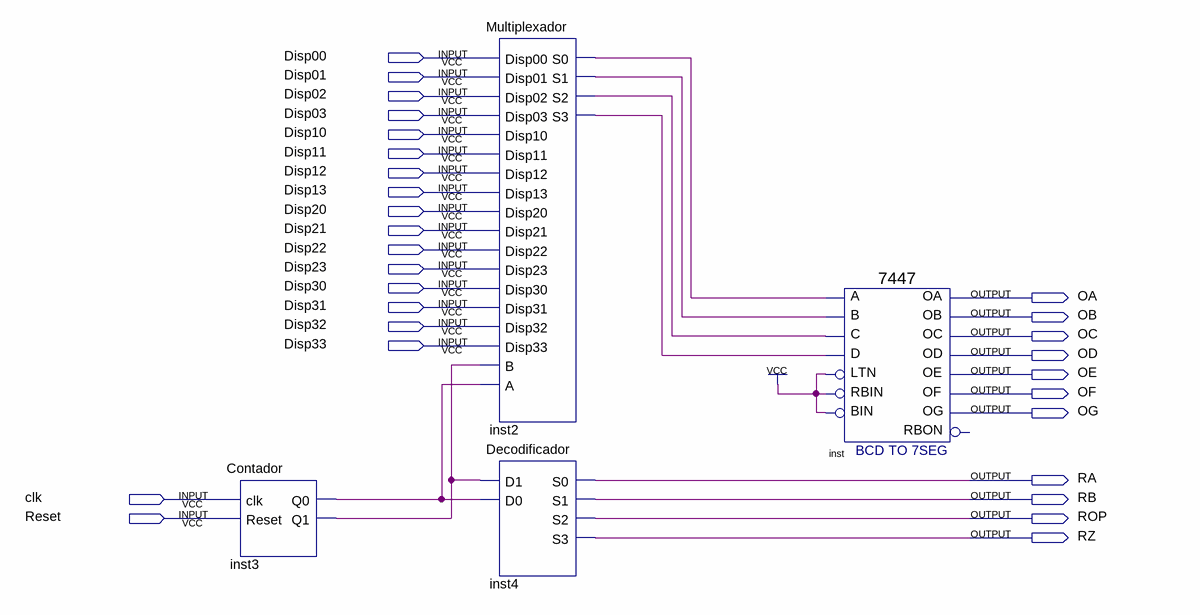
[diagram p0: schematic sheet]
// Quartus schematic Display.bdf as structural Verilog: 4 symbols, 29 pins
module Display (
  input  Disp00,
  input  Disp01,
  input  Disp02,
  input  Disp03,
  input  Disp10,
  input  Disp11,
  input  Disp12,
  input  Disp13,
  input  Disp20,
  input  Disp21,
  input  Disp22,
  input  Disp23,
  input  Disp30,
  input  Disp31,
  input  Disp32,
  input  Disp33,
  input  clk,
  input  Reset,
  output OA,
  output OB,
  output OC,
  output OD,
  output OE,
  output OF,
  output OG,
  output RA,
  output RB,
  output ROP,
  output RZ
);

  wire inst2_s0, inst2_s1, inst2_s2, inst2_s3, inst3_q0, inst3_q1;

  Contador inst3 (.clk(clk), .Reset(Reset), .Q0(inst3_q0), .Q1(inst3_q1));
  Multiplexador inst2 (
    .Disp00(Disp00), .Disp01(Disp01), .Disp02(Disp02), .Disp03(Disp03), .Disp10(Disp10), .Disp11(Disp11),
    .Disp12(Disp12), .Disp13(Disp13), .Disp20(Disp20), .Disp21(Disp21), .Disp22(Disp22), .Disp23(Disp23),
    .Disp30(Disp30), .Disp31(Disp31), .Disp32(Disp32), .Disp33(Disp33), .B(inst3_q1), .A(inst3_q0),
    .S0(inst2_s0), .S1(inst2_s1), .S2(inst2_s2), .S3(inst2_s3));
  Decodificador inst4 (.D1(inst3_q1), .D0(inst3_q0), .S0(RA), .S1(RB), .S2(ROP), .S3(RZ));
  \7447  inst (
    .LTN(1'b1), .B(inst2_s1), .C(inst2_s2), .D(inst2_s3), .RBIN(1'b1), .BIN(1'b1), .A(inst2_s0), .OB(OB),
    .OC(OC), .OE(OE), .OD(OD), .OF(OF), .OG(OG), .OA(OA));  // open: RBON
endmodule
